# Altium project DropletDetectorV2.PrjPcb
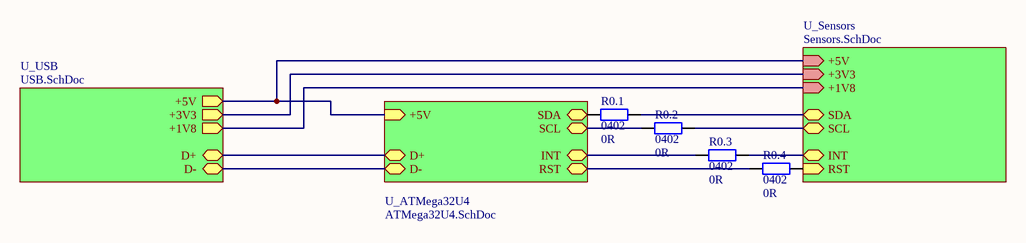
[diagram p0: Main.SchDoc]
4 sheets, 67 parts. Net scope: hierarchical (ports join the sheet entries above them; power ports are global).
Board files: Sensor.PcbDoc, LED.PcbDoc
Sheets:
  Main.SchDoc
    U_USB = USB.SchDoc
    U_ATMega32U4 = ATMega32U4.SchDoc
    U_Sensors = Sensors.SchDoc

## Sheet Main.SchDoc
size A4; SheetNumber: 1; SheetTotal: 4

### Parts
R0.1  0402  value 0R  [R0402_M]
R0.2  0402  value 0R  [R0402_M]
R0.3  0402  value 0R  [R0402_M]
R0.4  0402  value 0R  [R0402_M]

### Sub-sheets
U_ATMega32U4 = ATMega32U4.SchDoc: D+ (bidir), D- (bidir), SDA (bidir), SCL (bidir), INT (bidir), RST (bidir), +5V (in)
U_Sensors = Sensors.SchDoc: +1V8 (in), SDA (bidir), SCL (bidir), +3V3 (in), +5V (in), RST (in), INT (bidir)
U_USB = USB.SchDoc: D+ (bidir), D- (bidir), +1V8 (out), +3V3 (out), +5V (out)

### Nets
NetC1.2_2: sheet U_USB/+5V, sheet U_ATMega32U4/+5V, sheet U_Sensors/+5V
NetC1.5_2: sheet U_USB/+1V8, sheet U_Sensors/+1V8
NetC1.6_2: sheet U_USB/+3V3, sheet U_Sensors/+3V3
NetI2CMux_3: R0.4.2 ; sheet U_Sensors/RST
NetI2CMux_11: R0.3.2 ; sheet U_Sensors/INT
NetI2CMux_12: R0.2.2 ; sheet U_Sensors/SCL
NetI2CMux_13: R0.1.2 ; sheet U_Sensors/SDA
NetR0.1_1: R0.1.1 ; sheet U_ATMega32U4/SDA
NetR0.2_1: R0.2.1 ; sheet U_ATMega32U4/SCL
NetR0.3_1: R0.3.1 ; sheet U_ATMega32U4/INT
NetR0.4_1: R0.4.1 ; sheet U_ATMega32U4/RST
NetR1.3_2: sheet U_USB/D+, sheet U_ATMega32U4/D+
NetR1.4_2: sheet U_USB/D-, sheet U_ATMega32U4/D-

### Library data of the parts
R0.1-R0.4 = R0402_1%_0R: Resistor; Manufactor: Multicomp; ManufactorPartNumber: MC00625W040210R; Tech: Dickschicht; VoltageRating: 50V; PowerRating: 0,0625W; Tolerance: 1%; Part Number: R0402_1%_0R; Type: Resistor; Supplier 1: Farnell; Supplier Part Number 1: 1357983

## Sheet USB.SchDoc
size A4; SheetNumber: 3; SheetTotal: 4
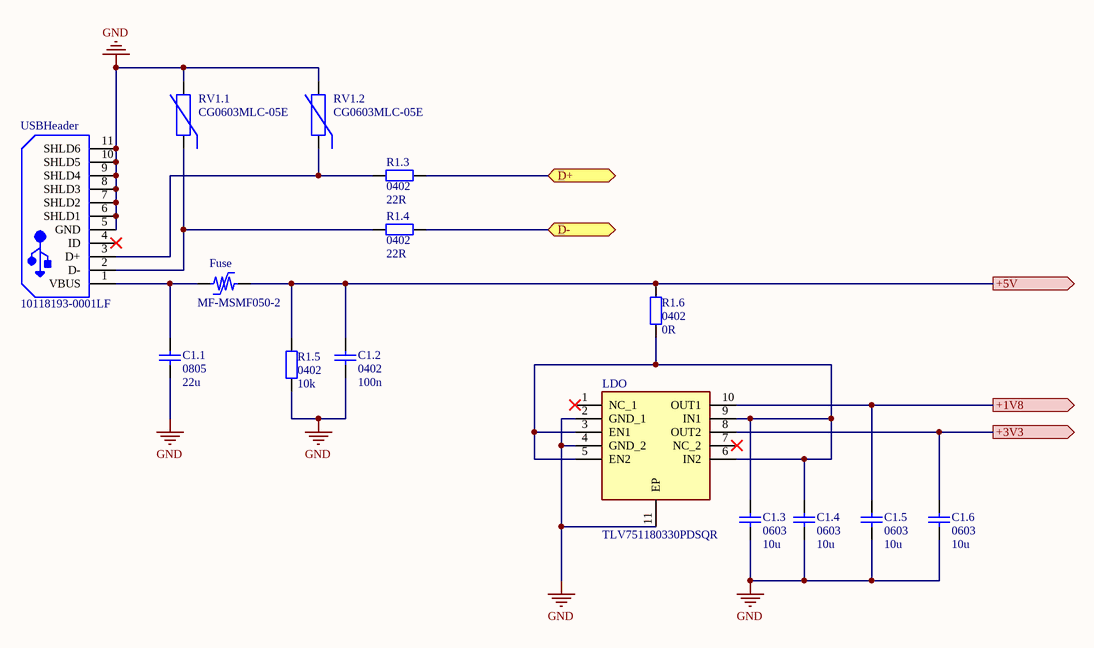
[diagram p1: USB.SchDoc]

### Parts
C1.1  0805  value 22u  [C0805_M]
C1.2  0402  value 100n  [C0402_M]
C1.3  0603  value 10u  [C0603_M]
C1.4  0603  value 10u  [C0603_M]
C1.5  0603  value 10u  [C0603_M]
C1.6  0603  value 10u  [C0603_M]
Fuse  MF-MSMF050-2  [BOUR-MF-MSMF050-2_V]
LDO  TLV751180330PDSQR  [SON40P200X200X80-11N]
R1.3  0402  value 22R  [R0402_M]
R1.4  0402  value 22R  [R0402_M]
R1.5  0402  value 10k  [R0402_M]
R1.6  0402  value 0R  [R0402_M]
RV1.1  CG0603MLC-05E  [BOUR-CG0603-2_V]
RV1.2  CG0603MLC-05E  [BOUR-CG0603-2_V]
USBHeader  10118193-0001LF  [FCI-10118193-0001LF-5_V]

### Ports
+1V8 (out), +3V3 (out), +5V (out), D+ (bidir), D- (bidir)

### Nets
GND: C1.1.1 C1.2.1 C1.3.1 C1.4.1 C1.5.1 C1.6.1 LDO.2(GND_1) LDO.4(GND_2) LDO.11(EP) R1.5.1 RV1.1.2 RV1.2.2 USBHeader.5(GND) USBHeader.6(SHLD1) USBHeader.7(SHLD2) USBHeader.8(SHLD3) USBHeader.9(SHLD4) USBHeader.10(SHLD5) USBHeader.11(SHLD6)
NetC1.1_2: C1.1.2 Fuse.1 USBHeader.1(VBUS)
NetC1.2_2: C1.2.2 Fuse.2 R1.5.2 R1.6.2 ; port +5V
NetC1.3_2: C1.3.2 C1.4.2 LDO.3(EN1) LDO.5(EN2) LDO.6(IN2) LDO.9(IN1) R1.6.1
NetC1.5_2: C1.5.2 LDO.10(OUT1) ; port +1V8
NetC1.6_2: C1.6.2 LDO.8(OUT2) ; port +3V3
NetR1.3_1: R1.3.1 RV1.2.1 USBHeader.3(D+)
NetR1.3_2: R1.3.2 ; port D+
NetR1.4_1: R1.4.1 RV1.1.1 USBHeader.2(D-)
NetR1.4_2: R1.4.2 ; port D-

Not connected (* = marked no-connect by the designer): LDO 1(NC_1)* 7(NC_2)*; USBHeader 4(ID)*

### Library data of the parts
C1.1 = C0805_X5R_22u_20%: Capacitor; Manufactor: Walsin; ManufactorPartNumber: 0805X226M6R3CT; Tech: MLCC X5R; VoltageRating: 6.3V; TempRating: -55°C to +125°C; Tolerance: 20%; Part Number: C0805_X5R_22u_20%; Type: Capacitor; Supplier 1: Farnell; Supplier Part Number 1: 2497053
C1.2 = C0402_X7R_100n_10%: Capacitor; Manufactor: Yageo; ManufactorPartNumber: CC0402KRX7R7BB104; Tech: MLCC X7R; VoltageRating: 16V; TempRating: -55°C to +125°C; Tolerance: 10%; Part Number: C0402_X7R_100n_10%; Type: Capacitor; Supplier 1: Farnell; Supplier Part Number 1: 9402047
C1.3-C1.6 = C0603_X5R_10u_10%: Capacitor; Manufactor: Yageo; ManufactorPartNumber: CC0603MRX5R5BB106; Tech: MLCC X5R; VoltageRating: 6,3V; TempRating: -55°C to +85°C; Tolerance: 10%; Part Number: C0603_X5R_10u_10%; Type: Capacitor; Supplier 1: Farnell; Supplier Part Number 1: 1458902
Fuse = CMP-2100-03653-1: PTC Resettable Fuse, 15 V, 500 mA, -40 to 85 degC, 2-Pin SMD, RoHS, Tape and Reel; Manufacturer: Bourns; Voltage Rating (DC): 15V; Max Current Rating: 100A; Power Dissipation: 800mW; Resistance: 150mOhm; Width: 3.41mm; Package Quantity: 2000; Voltage Rating: 15V; RoHSCompliant: true; Contact Plating: Gold; REACH SVHC: NoSVHC; Datasheet URL: http://www.bourns.com/docs/Product-Datasheets/mfmsmf.pdf; Lead Free: LeadFree; Height: 0.85mm; Min Operating Temperature: -40degC; Case Code (Metric): 4532; Number of Terminals: 2; Case Code (Imperial): 1812; Case/Package: 1812; Current Rating: 100A; Length: 4.73mm; Max Operating Temperature: 85degC; Package Reference: MF-MSMF050-2; Radiation Hardening: No; Datasheet Version: Rev. AG, 08/2016; Packaging: TapeandReel; Termination: SMD/SMT; Supply Voltage: 15V; Manufacturer URL: http://www.bourns.com/; Mount: SurfaceMount; Package Description: 2-Pin Surface Mount Device, Body 4.55 x 3.24 mm
LDO = TLV751180330PDSQR: Integrated Circuit; Manufacturer_Name: Texas Instruments; Datasheet Link: https://www.arrow.com/en/products/tlv751180330pdsqr/texas-instruments; Height: 0.8mm; Manufacturer_Part_Number: TLV751180330PDSQR; Mouser Part Number: 595-LV751180330PDSQR; Mouser Price/Stock: https://www.mouser.co.uk/ProductDetail/Texas-Instruments/TLV751180330PDSQR/?qs=TiOZkKH1s2TTHzmF98psZw%3D%3D; Arrow Part Number: TLV751180330PDSQR; Arrow Price/Stock: https://www.arrow.com/en/products/tlv751180330pdsqr/texas-instruments
R1.3 R1.4 = R0402_1%_220R: Resistor; Manufactor: Vishay; ManufactorPartNumber: CRCW0402220RFKEDHP; Tech: Dickschicht; VoltageRating: 50V; PowerRating: 0,125W; Tolerance: 1%; Part Number: R0402_1%_220R; Type: Resistor
R1.5 = R0402_1%_10k: Resistor; Manufactor: Vishay; ManufactorPartNumber: CRCW040210K0FKEDHP; Tech: Dickschicht; VoltageRating: 50V; PowerRating: 0,125W; Tolerance: 1%; Part Number: R0402_1%_10k; Type: Resistor; Supplier 1: Digi-Key; Supplier Part Number 1: 541-10.0KYCT-ND; Supplier 2: Farnell; Supplier Part Number 2: 1738864
R1.6 = R0402_1%_0R: as R0.1 on sheet Main; Part Number: R0402_1%_0R; Type: Resistor; Supplier 1: Farnell; Supplier Part Number 1: 1357983
RV1.1 RV1.2 = CMP-0584-00001-2: ESD Protector, 5 V Supply, -40 to 85 degC, 1.6 x 0.8 x 0.55 mm SMD, RoHS, Tape and Reel; Manufacturer: Bourns; VC: 20 V; VT: 150 V; RT: 1 ns; VDC: 5 V; CO: 0.5 pF; PartNumber: CG0603MLC-05E; ComponentLink1Description: Manufacturer URL; ComponentLink1URL: http://www.bourns.com/; Packing: Tape and Reel; Mounting Technology: Surface Mount; ComponentLink2Description: Datasheet; RoHS: TRUE; Operating Temperature: -40 to 85 degC; DatasheetVersion: Rev. S; PackageDescription: 2-Pin SMD, Body 1.6 x 0.8 mm, Pitch 1.52 mm; PackageReference: CG0603-2; ComponentLink2URL: http://www.bourns.com/data/global/pdfs/MLC.pdf
USBHeader = CMP-2000-05119-1: Micro USB B Type Receptacle, -55 to 85 degC, 5-Pin SMD, RoHS, Tape and Reel; Manufacturer: FCI; Insulation Resistance: 1000MOhms; Gender: Female; Current Rating: 1.8A; Number of Contacts: 5Contact; Connector Type: MicroUSBTypeBreceptacle; Mounting Angle: Right; Datasheet Version: Rev. C, 05/2015; Packaging: Reel; Product Category: USBConnectors; Standard: USB2.0; Factory Pack Quantity: 1200; Operating Temperature Range: -55Cto+85C; Termination Style: SMD/SMT; Datasheet URL: http://datasheet.octopart.com/10118193-0001LF-FCI-datasheet-55953155.pdf; Contact Material: CopperAlloy; RoHS: Details; Contact Plating: Gold; Flammability Rating: UL94V-0; Manufacturer URL: http://www.fci.com/; Brand: FCI; Product: MicroUSBTypeBConnectors; Color: Black

## Sheet ATMega32U4.SchDoc
size A4; SheetNumber: 2; SheetTotal: 4
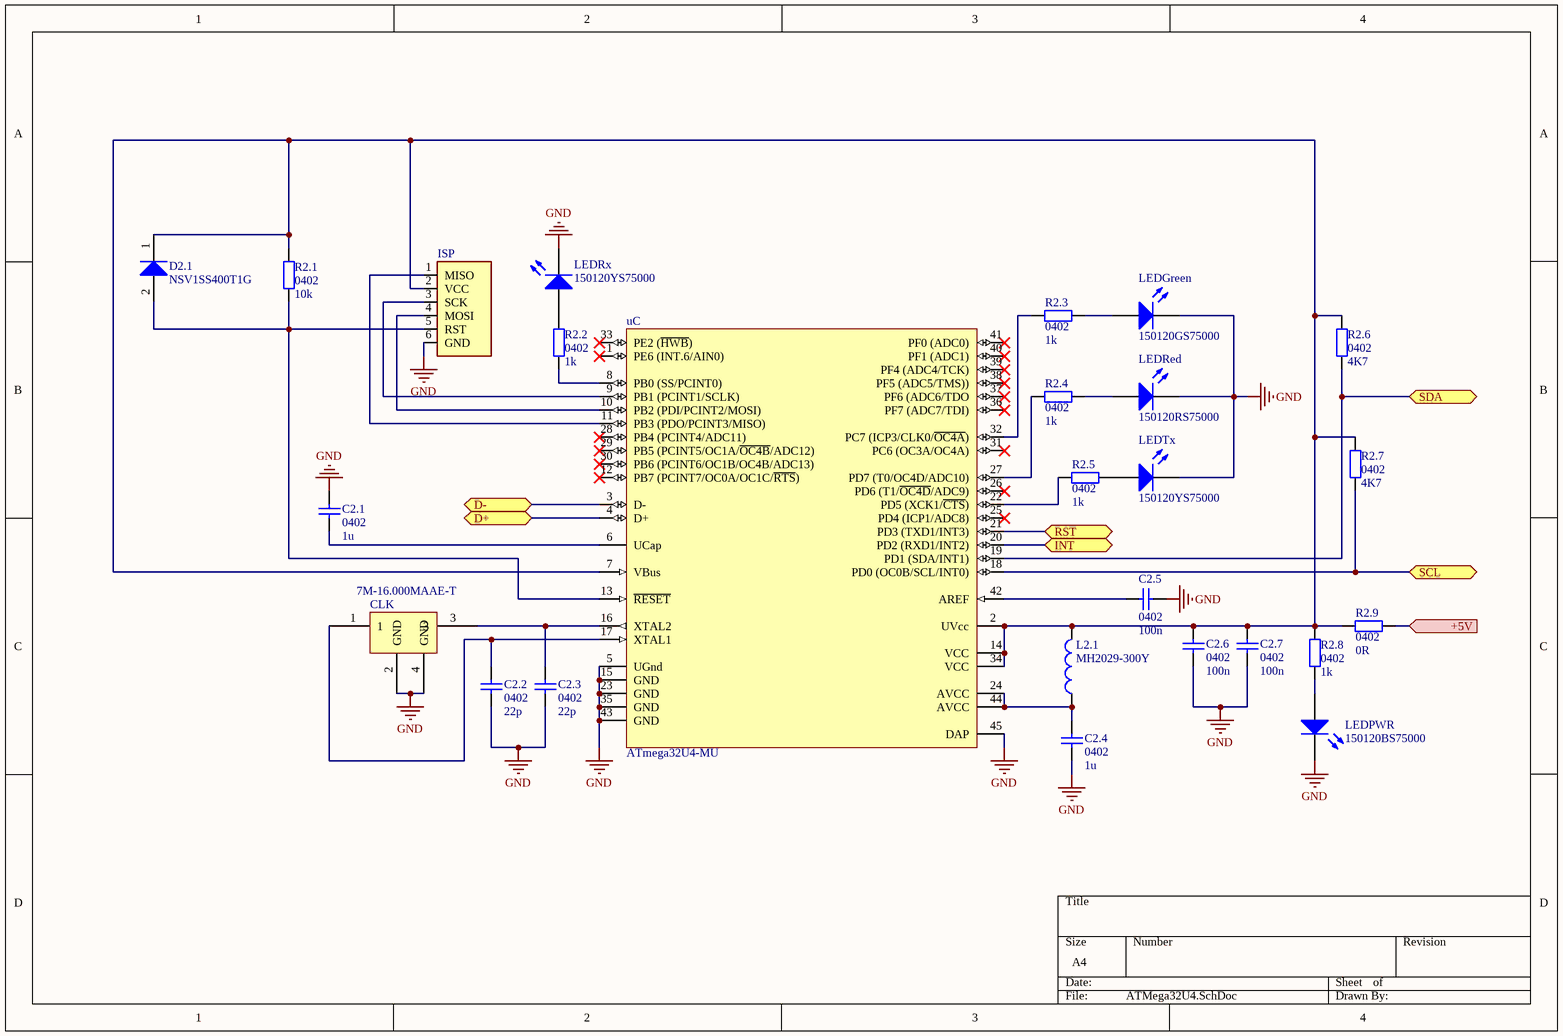
[diagram p2: ATMega32U4.SchDoc]

### Parts
C2.1  0402  value 1u  [C0402_M]
C2.2  0402  value 22p  [C0402_M]
C2.3  0402  value 22p  [C0402_M]
C2.4  0402  value 1u  [C0402_M]
C2.5  0402  value 100n  [C0402_M]
C2.6  0402  value 100n  [C0402_M]
C2.7  0402  value 100n  [C0402_M]
CLK  7M-16.000MAAE-T  [7M-16.000MAAE-T]
D2.1  NSV1SS400T1G  [ONSC-SOD-523-2-502-01_V]
ISP  (no value)  [TAG_TC2030-IDC-NL]  (no BOM)
L2.1  MH2029-300Y  [L0805_M]
LEDGreen  150120GS75000  [1206_A]
LEDPWR  150120BS75000  [1206_A]
LEDRed  150120RS75000  [1206_A]
LEDRx  150120YS75000  [1206_A]
LEDTx  150120YS75000  [1206_A]
R2.1  0402  value 10k  [R0402_M]
R2.2  0402  value 1k  [R0402_M]
R2.3  0402  value 1k  [R0402_M]
R2.4  0402  value 1k  [R0402_M]
R2.5  0402  value 1k  [R0402_M]
R2.6  0402  value 4K7  [R0402_M]
R2.7  0402  value 4K7  [R0402_M]
R2.8  0402  value 1k  [R0402_M]
R2.9  0402  value 0R  [R0402_M]
uC  ATmega32U4-MU  [44PW_M]

### Ports
+5V (in), D+ (bidir), D- (bidir), INT (bidir), RST (bidir), SCL (bidir), SDA (bidir)

### Nets
GND: C2.1.2 C2.2.1 C2.3.1 C2.4.1 C2.5.2 C2.6.1 C2.7.1 CLK.2(GND) CLK.4(GND) ISP.6(GND) LEDGreen.1(K) LEDPWR.1(K) LEDRed.1(K) LEDRx.1(K) LEDTx.1(K) uC.5(UGnd) uC.15(GND) uC.23(GND) uC.35(GND) uC.43(GND) uC.45(DAP)
NetC1.2_2: R2.9.2 ; port +5V
NetC2.1_1: C2.1.1 uC.6(UCap)
NetC2.2_2: C2.2.2 CLK.1 uC.17(XTAL1)
NetC2.3_2: C2.3.2 CLK.3 uC.16(XTAL2)
NetC2.4_2: C2.4.2 L2.1.1 uC.24(AVCC) uC.44(AVCC)
NetC2.5_1: C2.5.1 uC.42(AREF)
NetC2.6_2: C2.6.2 C2.7.2 D2.1.1(K) ISP.2(VCC) L2.1.2 R2.1.2 R2.6.2 R2.7.2 R2.8.2 R2.9.1 uC.2(UVcc) uC.7(VBus) uC.14(VCC) uC.34(VCC)
NetD2.1_2: D2.1.2(A) ISP.5(RST) R2.1.1 uC.13(~{RESET})
NetISP_1: ISP.1(MISO) uC.11(PB3_(PDO/PCINT3/MISO))
NetISP_3: ISP.3(SCK) uC.9(PB1_(PCINT1/SCLK))
NetISP_4: ISP.4(MOSI) uC.10(PB2_(PDI/PCINT2/MOSI))
NetLEDGreen_2: LEDGreen.2(A) R2.3.1
NetLEDPWR_2: LEDPWR.2(A) R2.8.1
NetLEDRed_2: LEDRed.2(A) R2.4.1
NetLEDRx_2: LEDRx.2(A) R2.2.2
NetLEDTx_2: LEDTx.2(A) R2.5.1
NetR0.1_1: R2.6.1 uC.19(PD1_(SDA/INT1)) ; port SDA
NetR0.2_1: R2.7.1 uC.18(PD0_(OC0B/SCL/INT0)) ; port SCL
NetR0.3_1: uC.20(PD2_(RXD1/INT2)) ; port INT
NetR0.4_1: uC.21(PD3_(TXD1/INT3)) ; port RST
NetR1.3_2: uC.4(D+) ; port D+
NetR1.4_2: uC.3(D-) ; port D-
NetR2.2_1: R2.2.1 uC.8(PB0_(SS/PCINT0))
NetR2.3_2: R2.3.2 uC.32(PC7_(ICP3/CLK0/~{OC4A}))
NetR2.4_2: R2.4.2 uC.27(PD7_(T0/OC4D/ADC10))
NetR2.5_2: R2.5.2 uC.22(PD5_(XCK1/~{CTS}))

Not connected (* = marked no-connect by the designer): uC 1(PE6_(INT.6/AIN0))* 12(PB7_(PCINT7/OC0A/OC1C/~{RTS}))* 25(PD4_(ICP1/ADC8))* 26(PD6_(T1/~{OC4D}/ADC9))* 28(PB4_(PCINT4/ADC11))* 29(PB5_(PCINT5/OC1A/~{OC4B}/ADC12))* 30(PB6_(PCINT6/OC1B/OC4B/ADC13))* 31(PC6_(OC3A/OC4A))* 33(PE2_(~{HWB}))* 36(PF7_(ADC7/TDI))* 37(PF6_(ADC6/TDO)* 38(PF5_(ADC5/TMS)))* 39(PF4_(ADC4/TCK))* 40(PF1_(ADC1))* 41(PF0_(ADC0))*

### Library data of the parts
C2.1 C2.4 = C0402_X5R_1u_10V_WE: Capacitor; Manufactor: WURTH ELEKTRONIK; ManufactorPartNumber: 885012105012; Tech: X5R; VoltageRating: 10V; TempRating: -55°C to +125°C; Tolerance: ±20%; Part Number: C0402_X5R_1u_10V_WE; Type: Capacitor; Supplier 1: Digi-Key; Supplier Part Number 1: 732-7489-1-ND
C2.2 C2.3 = C0402_NP0_22p_50V_WE: Capacitor; Manufactor: WURTH ELEKTRONIK; ManufactorPartNumber: 885012005057; Tech: NP0; VoltageRating: 50V; TempRating: -55°C to +125°C; Tolerance: ±5%; Part Number: C0402_NP0_22p_50V_WE; Type: Capacitor; Supplier 1: Digi-Key; Supplier Part Number 1: 732-7471-1-ND
C2.5-C2.7 = C0402_X7R_100n_10%: as C1.2 on sheet USB; Part Number: C0402_X7R_100n_10%; Type: Capacitor; Supplier 1: Farnell; Supplier Part Number 1: 9402047
D2.1 = CMP-1054-00078-1: High-Speed Switching Diode, 2-Pin SOD-523, Pb-Free, Tape and Reel; Manufacturer: On Semiconductor; IF Max (A): 0.2; Configuration: Single; trr Max (ns): 4; ComponentLink3URL: http://www.onsemi.com/pub_link/Collateral/502-01.PDF; PackageDescription: 2-Pin SOD, Body 1.2 x 0.8 mm; ComponentLink1URL: http://www.onsemi.com/; Mounting Technology: Surface Mount; ComponentLink1Description: Manufacturer URL; DatasheetVersion: Rev. 7; Packing: Tape and Reel; PackageVersion: Rev. E, 09/2010; RoHS: TRUE; PartNumber: NSV1SS400T1G; PackageReference: SOD-523-2-502-01; ComponentLink3Description: Package Specification; ComponentLink2Description: Datasheet; ComponentLink2URL: http://www.onsemi.com/pub_link/Collateral/1SS400T1-D.PDF
ISP = TC2030-IDC-NL: 6-PIN PLUG-OF-NAILS CABLE 6; MF: Tag-Connect; Package: Package Analog Devices; Availability: Unavailable; Value: *; MP: TC2030-IDC-NL; SnapEDA_Link: https://www.snapeda.com/parts/TC2030-IDC-NL/Tag-Connect/view-part/2783029/?ref=snap; Price: None
L2.1 = L0805_100n_2%: Manufactor: Coilcraft; ManufactorPartNumber: 0805CS-101XJLC; Kind: General; Value: 100n; CurrentRating: 400mA; TempRating: -40°C bis 125°C; Tolerance: 2%; Part Number: L0805_100n_2%; Supplier 1: Farnell; Supplier Part Number 1: 2286419
LEDGreen = CMP-1426-00014-1: SMD mono-color Chip LED, WL-SMCW, Green; Manufacturer: Wuerth Elektronik; PackageReference: 1206_A; PartNumber: 150120GS75000; ComponentLink1Description: Manufacturer URL; ComponentLink2URL: http://katalog.we-online.com/led/datasheet/150120GS75000.pdf; ComponentLink2Description: Datasheet; Color: Green; ComponentLink1URL: http://www.we-online.com
LEDPWR = CMP-1426-00015-1: SMD mono-color Chip LED, WL-SMCW, Blue; Manufacturer: Wuerth Elektronik; ComponentLink2Description: Datasheet; ComponentLink1URL: http://www.we-online.com; PartNumber: 150120BS75000; ComponentLink1Description: Manufacturer URL; ComponentLink2URL: http://katalog.we-online.com/led/datasheet/150120BS75000.pdf; PackageReference: 1206_A; Color: Blue
LEDRed = CMP-1426-00013-1: SMD mono-color Chip LED, WL-SMCW, Red; Manufacturer: Wuerth Elektronik; Color: Red; ComponentLink2URL: http://katalog.we-online.com/led/datasheet/150120RS75000.pdf; ComponentLink2Description: Datasheet; ComponentLink1Description: Manufacturer URL; ComponentLink1URL: http://www.we-online.com; PartNumber: 150120RS75000; PackageReference: 1206_A
LEDRx LEDTx = CMP-1426-00019-1: SMD mono-color Chip LED, WL-SMCW, Yellow; Manufacturer: Wuerth Elektronik; ComponentLink2URL: http://katalog.we-online.com/led/datasheet/150120YS75000.pdf; PartNumber: 150120YS75000; ComponentLink1URL: http://www.we-online.com; Color: Yellow; ComponentLink1Description: Manufacturer URL; PackageReference: 1206_A; ComponentLink2Description: Datasheet
R2.1 = R0402_1%_10k: as R1.5 on sheet USB; Part Number: R0402_1%_10k; Type: Resistor; Supplier 1: Digi-Key; Supplier Part Number 1: 541-10.0KYCT-ND; Supplier 2: Farnell; Supplier Part Number 2: 1738864
R2.2-R2.5 R2.8 = R0402_1%_1k: Resistor; Manufactor: Vishay; ManufactorPartNumber: CRCW04021K00FKED; Tech: Dickschicht; VoltageRating: 50V; PowerRating: 0,063W; Tolerance: 1%; Part Number: R0402_1%_1k; Type: Resistor; Supplier 1: Digi-Key; Supplier Part Number 1: 541-1.00KLCT-ND; Supplier 2: Farnell; Supplier Part Number 2: 1469662
R2.6 R2.7 = R0402_1%_3k3: Resistor; Manufactor: Yageo; ManufactorPartNumber: RC0402FR-073K3L; Tech: Dickschicht; VoltageRating: 50V; PowerRating: 0,0625W; Tolerance: 1%; Part Number: R0402_1%_3k3; Type: Resistor
R2.9 = R0402_1%_0R: as R0.1 on sheet Main; Part Number: R0402_1%_0R; Type: Resistor; Supplier 1: Farnell; Supplier Part Number 1: 1357983
uC = CMP-0095-00166-2: 8-bit AVR Microcontroller, 2.7-5.5V, 16MHz, 32KB Flash, 1KB EEPROM, 2.5KB SRAM, USB Controller, 44-pin QFN, Industrial Grade (-40°C to 85°C), Ext Osc; PackageVersion: revG, Sep-2009; PackageReference: 44PW; ComponentLink1URL: http://www.atmel.com/; PackageDescription: 44-Pin Quad Flat No-Lead Package, 7 x 7 mm Body, 0.5 mm Pitch (QFN); ComponentLink3Description: ATmega16U4 ATmega32U4 Summary; RevisionNote: DatasheetVersion, PackageVersion & PCB updated. URLs added.; ComponentLink2Description: ATmega16U4/32U4 Datasheet; ComponentLink1Description: Manufacturer URL; ComponentLink3URL: http://www.atmel.com/dyn/resources/prod_documents/7766S.pdf; DatasheetVersion: revF, Nov-2010; ComponentLink2URL: http://www.atmel.com/dyn/resources/prod_documents/doc7766.pdf; Code_JEDEC: MO-220-VKKD-1

## Sheet Sensors.SchDoc
size A4; SheetNumber: 4; SheetTotal: 4
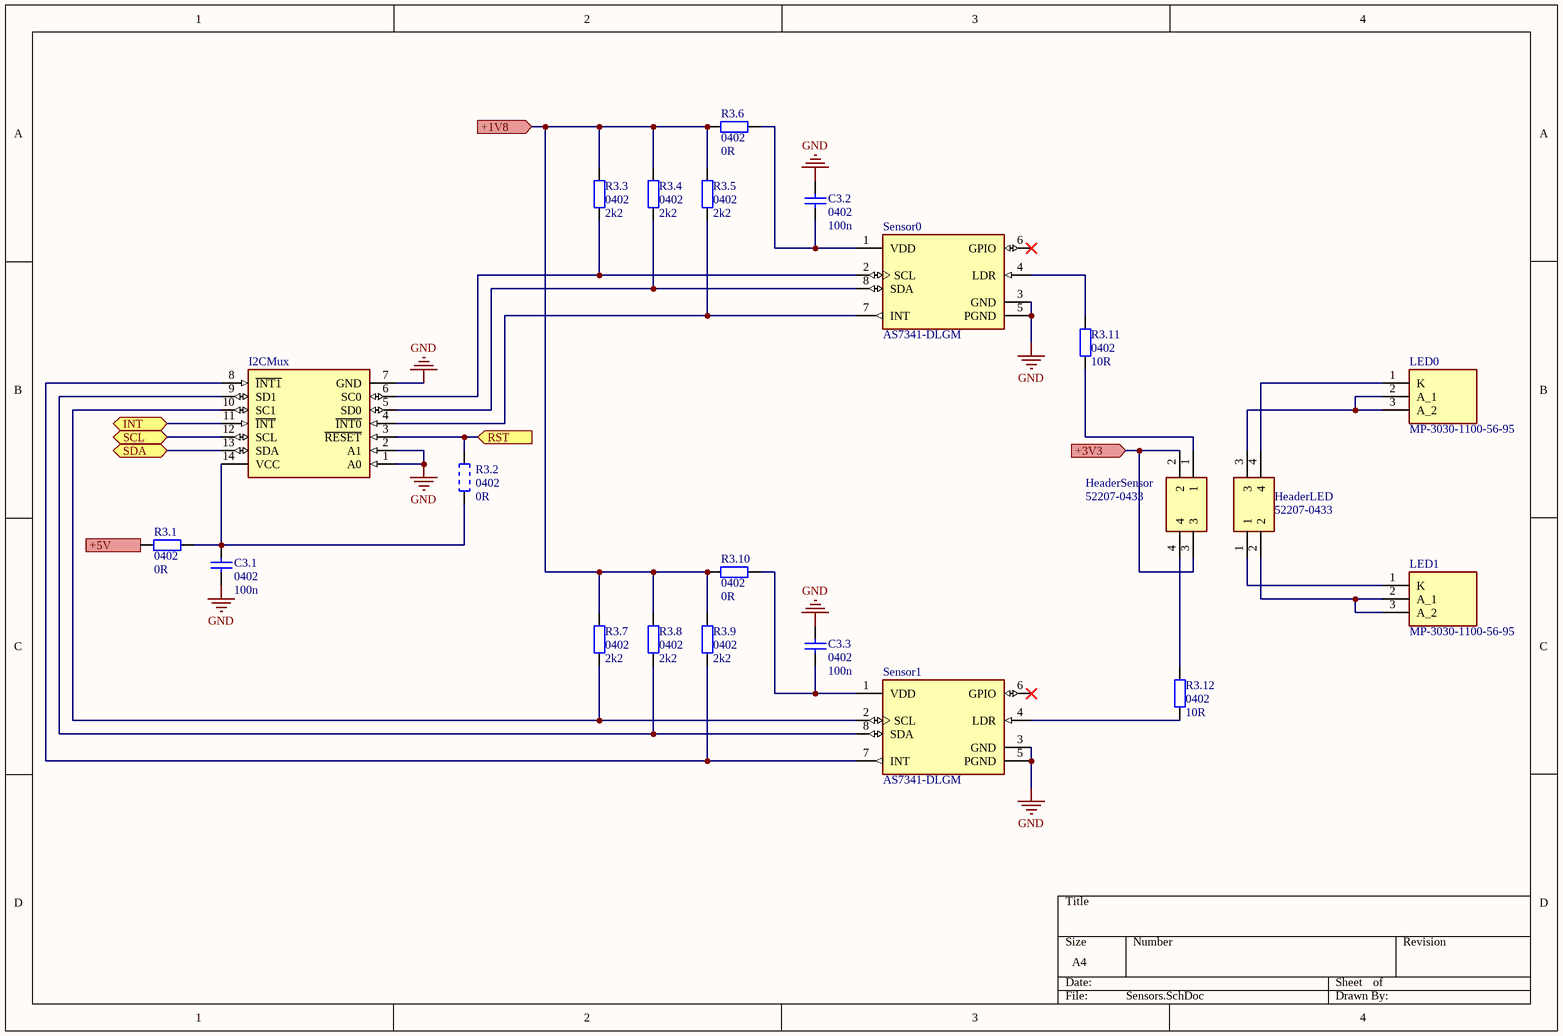
[diagram p3: Sensors.SchDoc]

### Parts
C3.1  0402  value 100n  [C0402_M]
C3.2  0402  value 100n  [C0402_M]
C3.3  0402  value 100n  [C0402_M]
HeaderLED  52207-0433  [52207-0433]
HeaderSensor  52207-0433  [52207-0433]
I2CMux  (no value)  [SOIC127P600X175-14N]
LED0  MP-3030-1100-56-95  [MP303011005780]
LED1  MP-3030-1100-56-95  [MP303011005780]
R3.1  0402  value 0R  [R0402_M]
R3.2  0402  value 0R  [R0402_M_open]  (no BOM)
R3.3  0402  value 2k2  [R0402_M]
R3.4  0402  value 2k2  [R0402_M]
R3.5  0402  value 2k2  [R0402_M]
R3.6  0402  value 0R  [R0402_M]
R3.7  0402  value 2k2  [R0402_M]
R3.8  0402  value 2k2  [R0402_M]
R3.9  0402  value 2k2  [R0402_M]
R3.10  0402  value 0R  [R0402_M]
R3.11  0402  value 10R  [R0402_M]
R3.12  0402  value 10R  [R0402_M]
Sensor0  AS7341-DLGM  [FP-AS7341-DLGM-MFG]
Sensor1  AS7341-DLGM  [FP-AS7341-DLGM-MFG]

### Ports
+1V8 (in), +3V3 (in), +5V (in), INT (bidir), RST (in), SCL (bidir), SDA (bidir)

### Nets
GND: C3.1.1 C3.2.2 C3.3.2 I2CMux.1(A0) I2CMux.2(A1) I2CMux.7(GND) Sensor0.3(GND) Sensor0.5(PGND) Sensor1.3(GND) Sensor1.5(PGND)
NetC1.2_2: R3.1.1 ; port +5V
NetC1.5_2: R3.3.2 R3.4.2 R3.5.2 R3.6.1 R3.7.2 R3.8.2 R3.9.2 R3.10.1 ; port +1V8
NetC1.6_2: HeaderSensor.2 HeaderSensor.3 ; port +3V3
NetC3.1_2: C3.1.2 I2CMux.14(VCC) R3.1.2 R3.2.1
NetC3.2_1: C3.2.1 R3.6.2 Sensor0.1(VDD)
NetC3.3_1: C3.3.1 R3.10.2 Sensor1.1(VDD)
NetHeaderLED_1: HeaderLED.1 LED1.1(K)
NetHeaderLED_2: HeaderLED.2 LED1.2(A_1) LED1.3(A_2)
NetHeaderLED_3: HeaderLED.3 LED0.2(A_1) LED0.3(A_2)
NetHeaderLED_4: HeaderLED.4 LED0.1(K)
NetHeaderSensor_1: HeaderSensor.1 R3.11.1
NetHeaderSensor_4: HeaderSensor.4 R3.12.2
NetI2CMux_3: I2CMux.3(~{RESET}) R3.2.2 ; port RST
NetI2CMux_4: I2CMux.4(~{INT0}) R3.5.1 Sensor0.7(INT)
NetI2CMux_5: I2CMux.5(SD0) R3.4.1 Sensor0.8(SDA)
NetI2CMux_6: I2CMux.6(SC0) R3.3.1 Sensor0.2(SCL)
NetI2CMux_8: I2CMux.8(~{INT1}) R3.9.1 Sensor1.7(INT)
NetI2CMux_9: I2CMux.9(SD1) R3.8.1 Sensor1.8(SDA)
NetI2CMux_10: I2CMux.10(SC1) R3.7.1 Sensor1.2(SCL)
NetI2CMux_11: I2CMux.11(~{INT}) ; port INT
NetI2CMux_12: I2CMux.12(SCL) ; port SCL
NetI2CMux_13: I2CMux.13(SDA) ; port SDA
NetR3.11_2: R3.11.2 Sensor0.4(LDR)
NetR3.12_1: R3.12.1 Sensor1.4(LDR)

Not connected (* = marked no-connect by the designer): Sensor0 6(GPIO)*; Sensor1 6(GPIO)*

### Library data of the parts
C3.1-C3.3 = C0402_X5R_100n_10%: Capacitor; Manufactor: Yageo; ManufactorPartNumber: CC0402KRX5R7BB104; Tech: MLCC X5R; VoltageRating: 16V; TempRating: -55°C to +85°C; Tolerance: 10%; Part Number: C0402_X5R_100n_10%; Type: Capacitor; Supplier 1: Farnell; Supplier Part Number 1: 1816750; Supplier 2: Digi-Key; Supplier Part Number 2: 311-1347-1-ND
HeaderLED HeaderSensor = 52207-0433: Connector; Manufacturer_Name: Molex; Datasheet Link: http://www.molex.com/pdm_docs/sd/522072033_sd.pdf; Manufacturer_Part_Number: 52207-0433; Mouser Part Number: 538-52207-0433; Mouser Price/Stock: https://www.mouser.co.uk/ProductDetail/Molex/52207-0433?qs=rw2VfpiI%2FsN5C%252BrnOc9sng%3D%3D
I2CMux = TCA9543ADR: Integrated Circuit; Manufacturer_Name: Texas Instruments; Datasheet Link: http://www.ti.com/lit/gpn/tca9543a; Height: 1.75mm; Manufacturer_Part_Number: TCA9543ADR; Mouser Part Number: 595-TCA9543ADR; Mouser Price/Stock: https://www.mouser.co.uk/ProductDetail/Texas-Instruments/TCA9543ADR/?qs=WuTGPxIYnC6YhvyolILbYg%3D%3D; Arrow Part Number: TCA9543ADR; Arrow Price/Stock: https://www.arrow.com/en/products/tca9543adr/texas-instruments
LED0 LED1 = MP-3030-1100-57-80: LED; Manufacturer_Name: Luminus Devices Inc.; Datasheet Link: https://www.mouser.jp/datasheet/2/245/Luminus_MP3030_1100_Datasheet-1512110.pdf; Height: 0.52mm; Manufacturer_Part_Number: MP-3030-1100-56-95
R3.1 = R0402_1%_0R: as R0.1 on sheet Main; Part Number: R0402_1%_0R; Type: Resistor; Supplier 1: Farnell; Supplier Part Number 1: 1357983
R3.2 = Res0402open: Resistor; Part Number: Res0402open; Type: Resistor
R3.3-R3.5 R3.7-R3.9 = R0402_1%_1k: as R2.2 on sheet ATMega32U4; Part Number: R0402_1%_1k; Type: Resistor
R3.6 R3.10 = R0402_0R: Resistor; Manufactor: Yageo; ManufactorPartNumber: RC0402JR-070RL; Tech: Dickschicht; VoltageRating: 50V; PowerRating: 0,0625W; Tolerance: 1%; Part Number: R0402_0R; Type: Resistor; Supplier 1: Digi-Key; Supplier Part Number 1: 311-0.0JRCT-ND
R3.11 R3.12 = R0402_1%_100R: Resistor; Manufactor: Vishay; ManufactorPartNumber: CRCW0402100RFKEDHP; Tech: Dickschicht; VoltageRating: 50V; PowerRating: 0,125W; Tolerance: 1%; Part Number: R0402_1%_100R; Type: Resistor
Sensor0 Sensor1 = CMP-22831-000004-1: SENSOR AMBIENT LIGHT

## Nets that join several sheets
GND: USB (19 pins), ATMega32U4 (21 pins), Sensors (10 pins)
NetC1.2_2: USB (C1.2.2 Fuse.2 R1.5.2 R1.6.2), ATMega32U4 (R2.9.2), Sensors (R3.1.1)
NetC1.5_2: USB (C1.5.2 LDO.10), Sensors (8 pins)
NetC1.6_2: USB (C1.6.2 LDO.8), Sensors (HeaderSensor.2 HeaderSensor.3)
NetI2CMux_3: Main (R0.4.2), Sensors (I2CMux.3 R3.2.2)
NetI2CMux_11: Main (R0.3.2), Sensors (I2CMux.11)
NetI2CMux_12: Main (R0.2.2), Sensors (I2CMux.12)
NetI2CMux_13: Main (R0.1.2), Sensors (I2CMux.13)
NetR0.1_1: Main (R0.1.1), ATMega32U4 (R2.6.1 uC.19)
NetR0.2_1: Main (R0.2.1), ATMega32U4 (R2.7.1 uC.18)
NetR0.3_1: Main (R0.3.1), ATMega32U4 (uC.20)
NetR0.4_1: Main (R0.4.1), ATMega32U4 (uC.21)
NetR1.3_2: USB (R1.3.2), ATMega32U4 (uC.4)
NetR1.4_2: USB (R1.4.2), ATMega32U4 (uC.3)